# EAGLE schematic seq__control_pad (EAGLE 7.7.0)
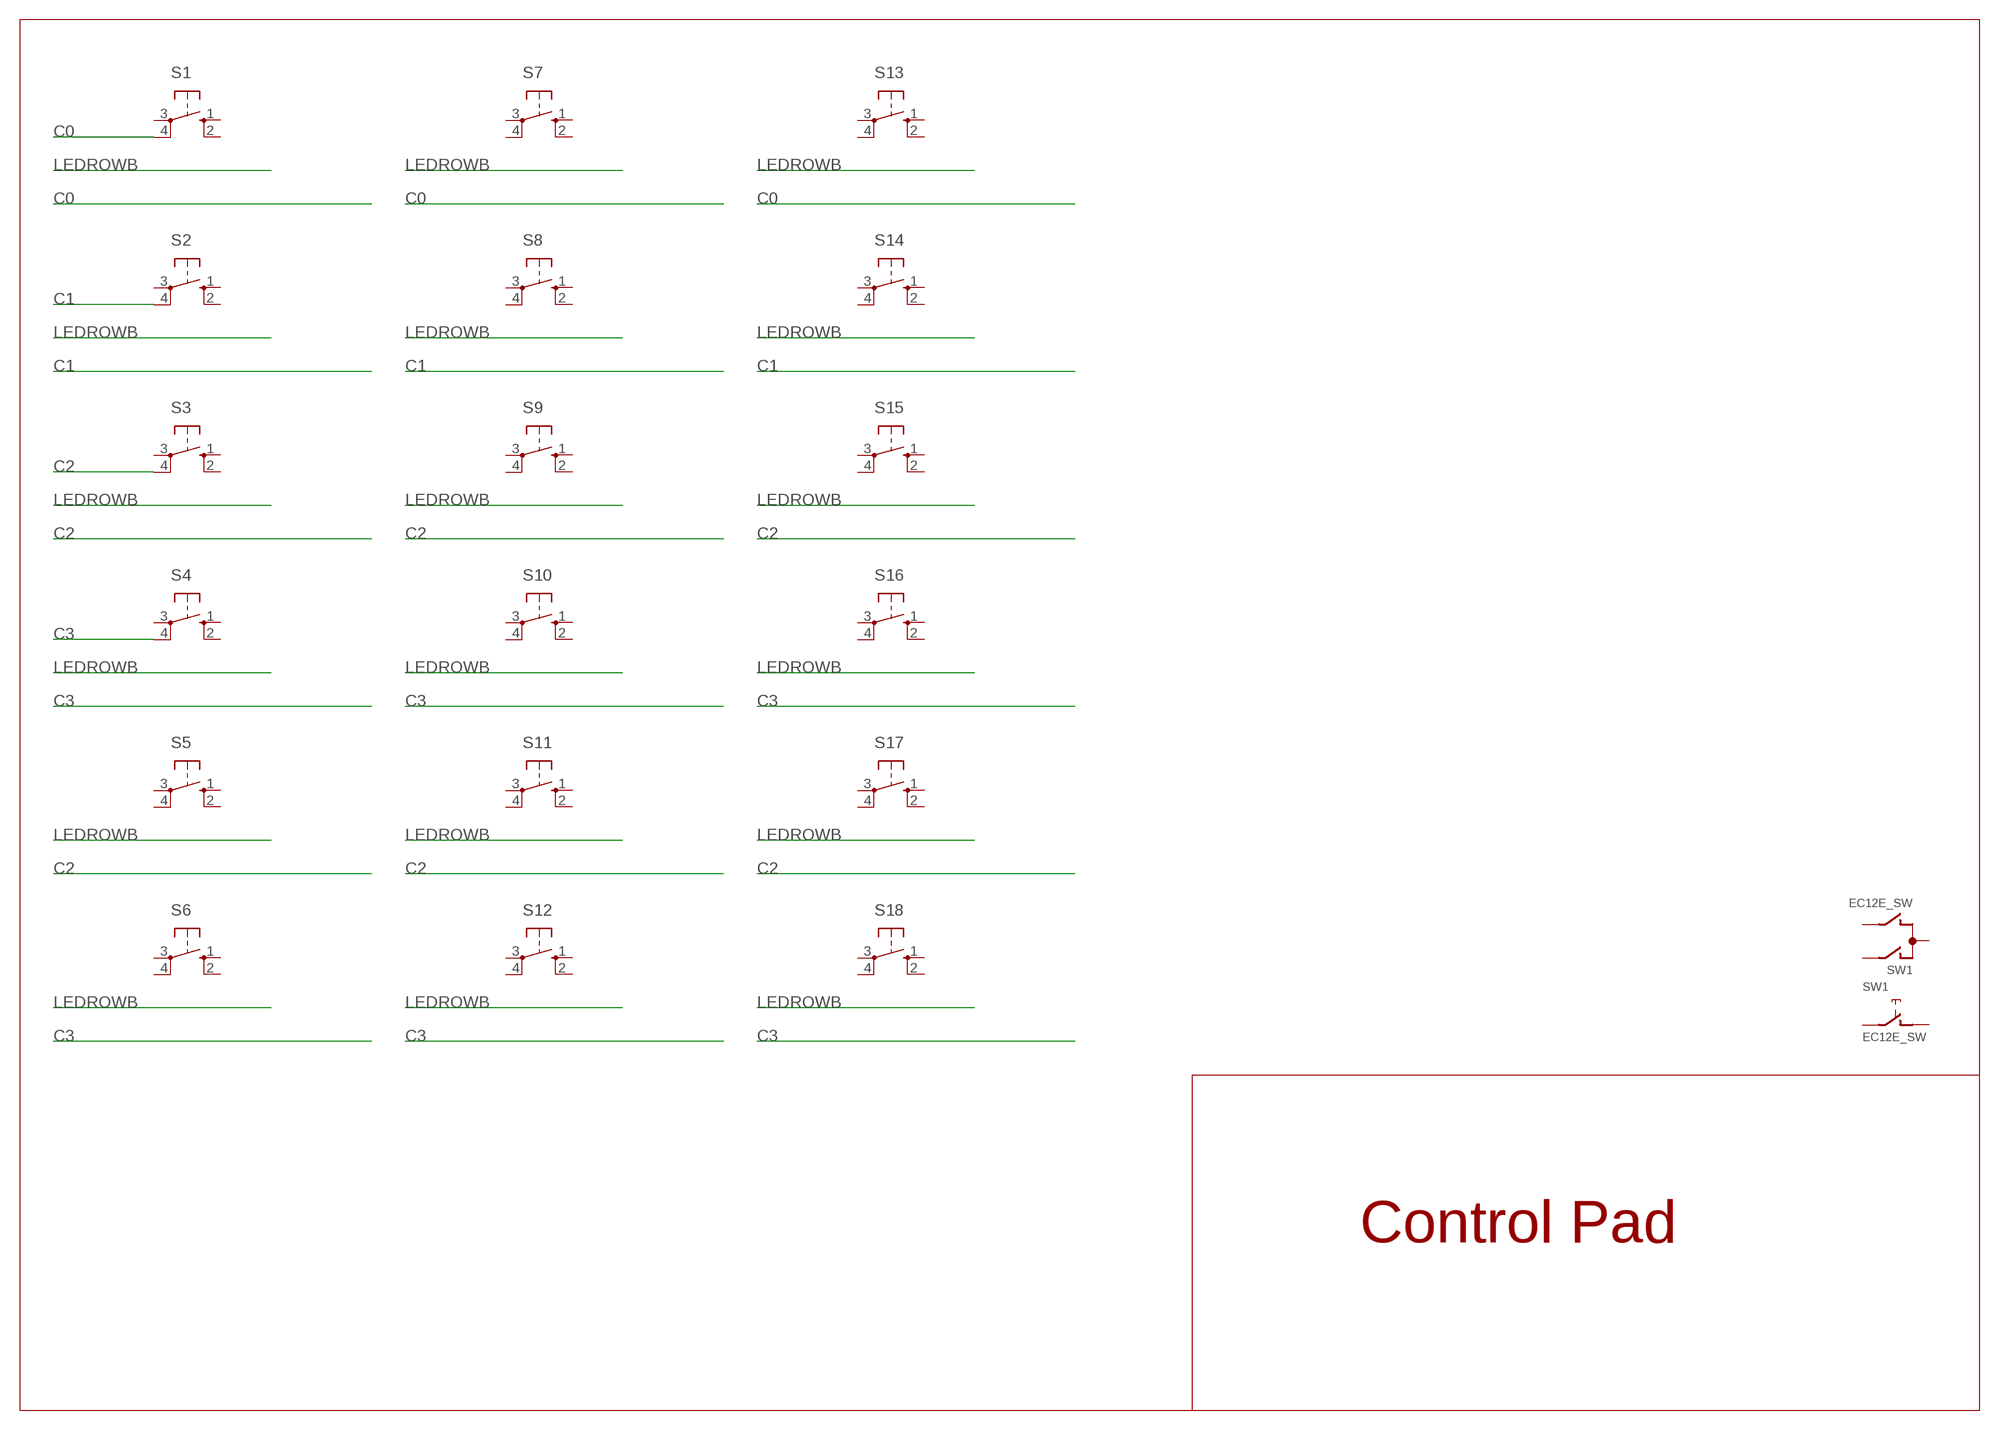
[diagram p0: schematic, sheet 1]

## Parts
S1  40-XX  [B3F-40XX]
S2  40-XX  [B3F-40XX]
S3  40-XX  [B3F-40XX]
S4  40-XX  [B3F-40XX]
S5  40-XX  [B3F-40XX]
S6  40-XX  [B3F-40XX]
S7  40-XX  [B3F-40XX]
S8  40-XX  [B3F-40XX]
S9  40-XX  [B3F-40XX]
S10  40-XX  [B3F-40XX]
S11  40-XX  [B3F-40XX]
S12  40-XX  [B3F-40XX]
S13  40-XX  [B3F-40XX]
S14  40-XX  [B3F-40XX]
S15  40-XX  [B3F-40XX]
S16  40-XX  [B3F-40XX]
S17  40-XX  [B3F-40XX]
S18  40-XX  [B3F-40XX]
SW1  EC12E_SW  [ALPS_EC12E_SW]

## Nets
C0: S1.4(P1)
C1: S2.4(P1)
C2: S3.4(P1)
C3: S4.4(P1)
Unconnected: S1.1(S) S1.2(S1) S1.3(P) S2.1(S) S2.2(S1) S2.3(P) S3.1(S) S3.2(S1) S3.3(P) S4.1(S) S4.2(S1) S4.3(P) S5.1(S) S5.2(S1) S5.3(P) S5.4(P1) S6.1(S) S6.2(S1) S6.3(P) S6.4(P1) S7.1(S) S7.2(S1) S7.3(P) S7.4(P1) S8.1(S) S8.2(S1) S8.3(P) S8.4(P1) S9.1(S) S9.2(S1) S9.3(P) S9.4(P1) S10.1(S) S10.2(S1) S10.3(P) S10.4(P1) S11.1(S) S11.2(S1) S11.3(P) S11.4(P1) S12.1(S) S12.2(S1) S12.3(P) S12.4(P1) S13.1(S) S13.2(S1) S13.3(P) S13.4(P1) S14.1(S) S14.2(S1) S14.3(P) S14.4(P1) S15.1(S) S15.2(S1) S15.3(P) S15.4(P1) S16.1(S) S16.2(S1) S16.3(P) S16.4(P1) S17.1(S) S17.2(S1) S17.3(P) S17.4(P1) S18.1(S) S18.2(S1) S18.3(P) S18.4(P1) SW1.A SW1.B SW1.C SW1.D SW1.E SW1.GND1(G) SW1.GND2(G)

## Notes on the sheet
- Control Pad

## Library data of the parts
S1-S18 = switch-omron:40-XX: OMRON SWITCH; MF: OMRON COMPONENTS USA; MPN: B3F-4000; OC_FARNELL: 176434; OC_NEWARK: 36K3105
SW1 = switch-alps:EC12E_SW: ALPS rotary Encoder EC12E series with switch; MPN: EC12E2424407; OC_FARNELL: 1520813; OC_NEWARK: 74M1068